# Altium project FPGA_Tester_Board.PrjPcb
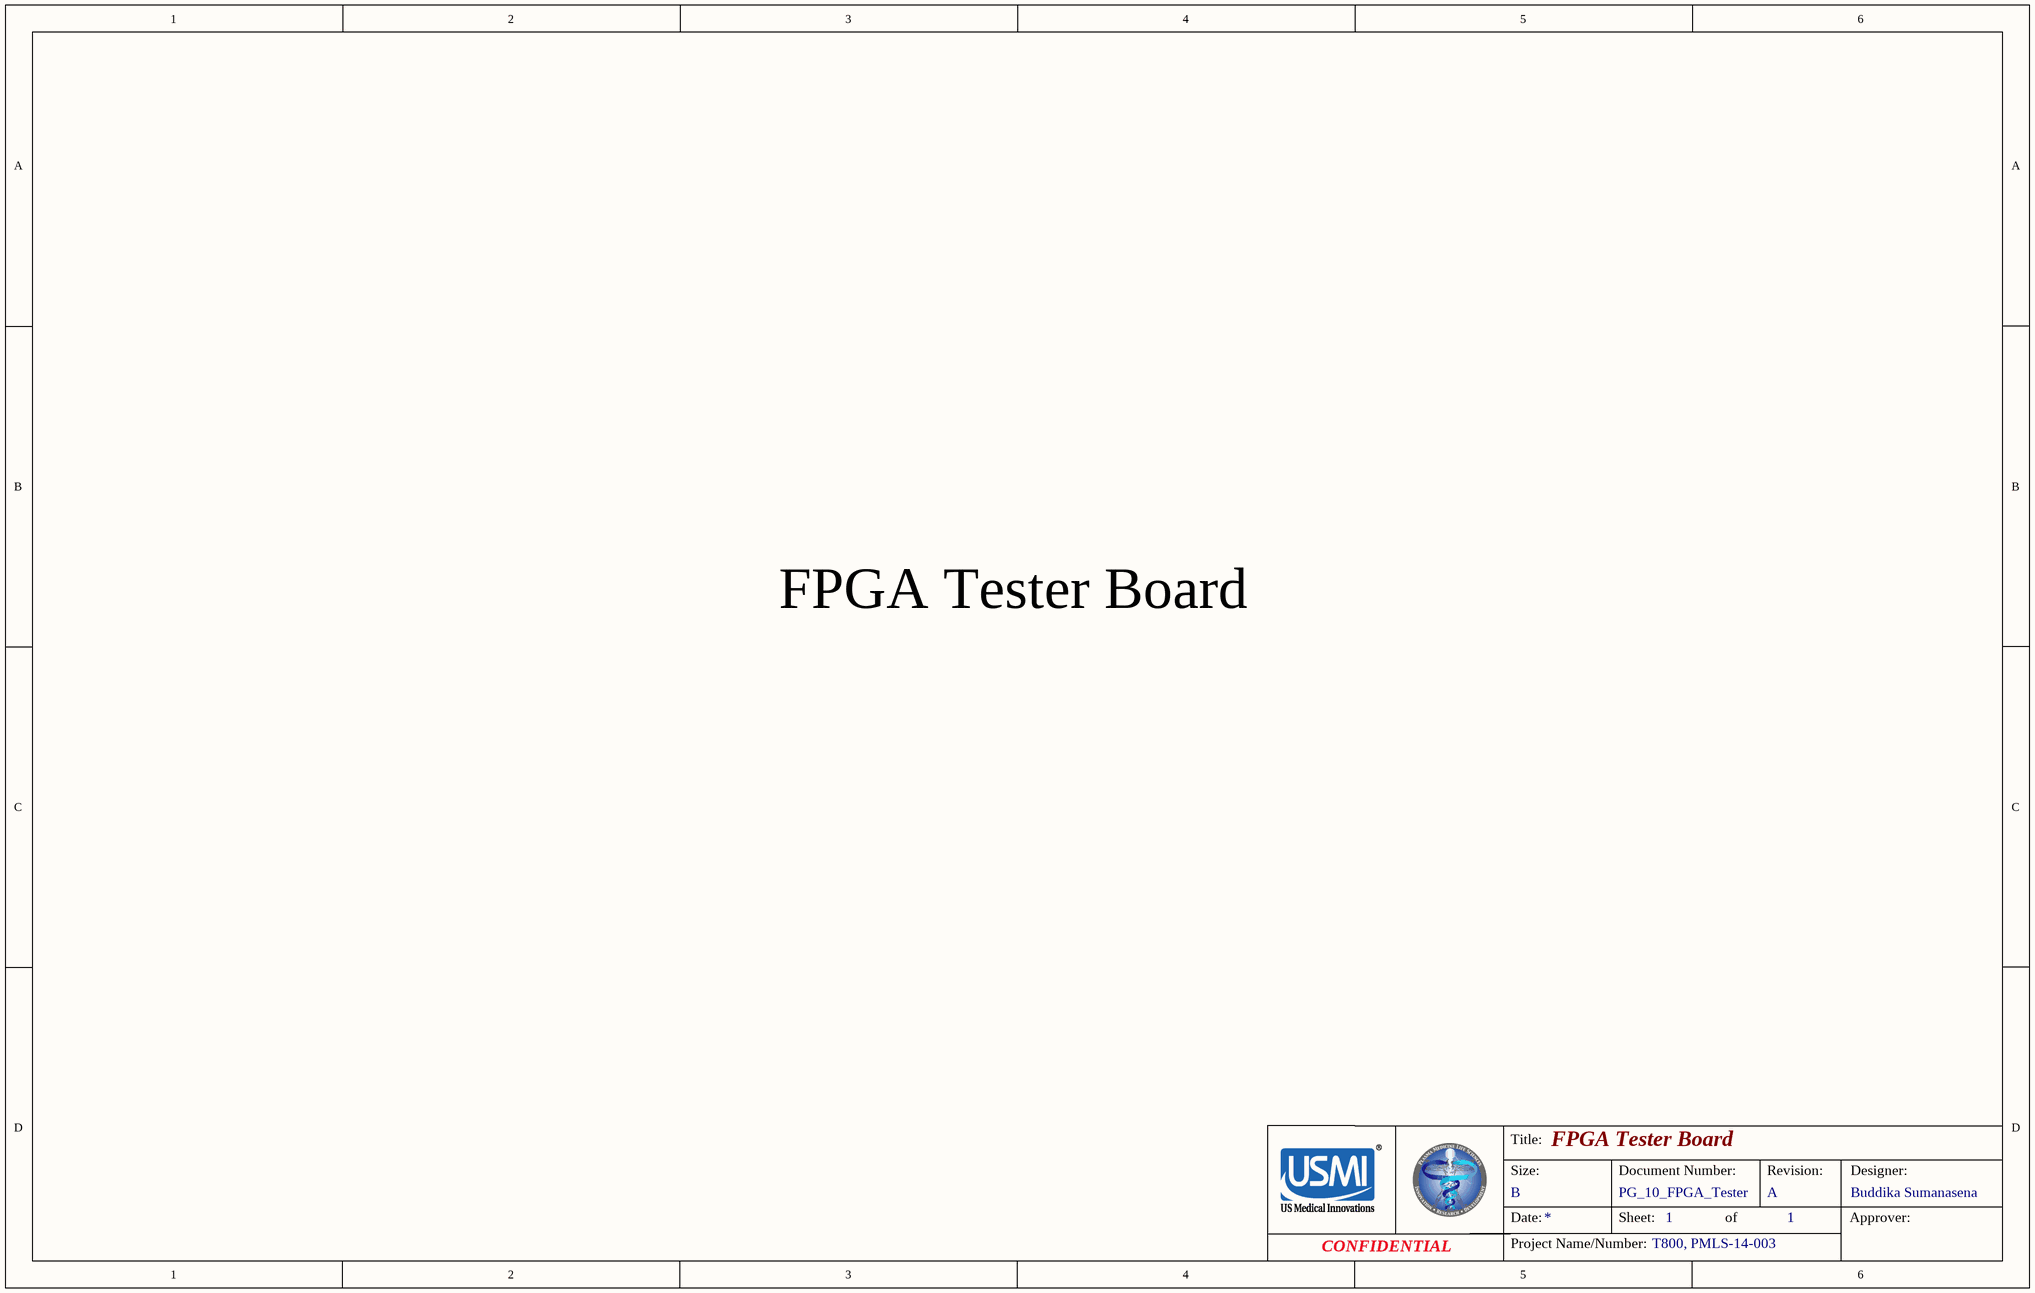
[diagram p0: FPGA_Tester_Board_Cover.SchDoc]
ApprovalDate: 0/31/2019; Author: Buddika Sumanasena; Document_number: PG_10_FPGA_Tester; PCBName: .Pcbdoc; ProjectName/Number: T800, PMLS-14-003; Revision: A; StartDate: 01/31/2019; Title: FPGA Tester Board
5 sheets, 19 parts. Net scope: strictly hierarchical (ports join the sheet entries above them; power ports are local).
Board files: FPGA_Tester_Board.PcbDoc, MainBoard V9.PcbDoc
Sheets:
  FPGA_Tester_Board_Cover.SchDoc
  FPGA_Tester_Board_Signals.SchDoc
    3V3_to_5V_Converter_1 = FPGA_Board_for_Generator__3V3_to_5V_Conv.SchDoc
    Power_Input = Power_Input_Circuit.SchDoc
    MUX_8_TO_1_1 = Multiplexer_8_to_1.SchDoc
    MUX_8_TO_1_2 = Multiplexer_8_to_1.SchDoc

## Sheet FPGA_Tester_Board_Cover.SchDoc: FPGA Tester Board
size B; Author: Buddika Sumanasena; Organization: Altium Limited; Address1: L3, 12a Rodborough Rd; Address2: Frenchs Forest; Address3: NSW; Address4: Australia 2086; Revision: A; SheetNumber: 1; SheetTotal: 1

### Notes on the sheet
- FPGA Tester Board
- Title:
- Size:
- Document Number:
- Revision:
- Designer:
- Date:
- Project Name/Number:
- B
- Sheet:
- of
- Approver:
- CONFIDENTIAL

## Sheet FPGA_Tester_Board_Signals.SchDoc: FPGA Tester Board
size B; Author: Buddika Sumanasena; Organization: Altium Limited; Address1: L3, 12a Rodborough Rd; Address2: Frenchs Forest; Address3: NSW; Address4: Australia 2086; DocumentNumber: 11; Revision: A; SheetNumber: 8; SheetTotal: 21; PageSetup: Record=PageOptions|CenterHorizontal=True|CenterVertical=True|PrintScale=0.72|XCorrection=1.00|YCorrection=1.00|PrintKind=1|BorderSize=5000000|LeftOffset=0|BottomOffset=0|Orientation=2|PaperLength=2794|PaperWidth=2159|Scale=100|PaperSource=7|PrintQuality=600|MediaType=1|DitherType=10|PrintScaleMode=1|PaperKind=Letter|PaperIndex=1
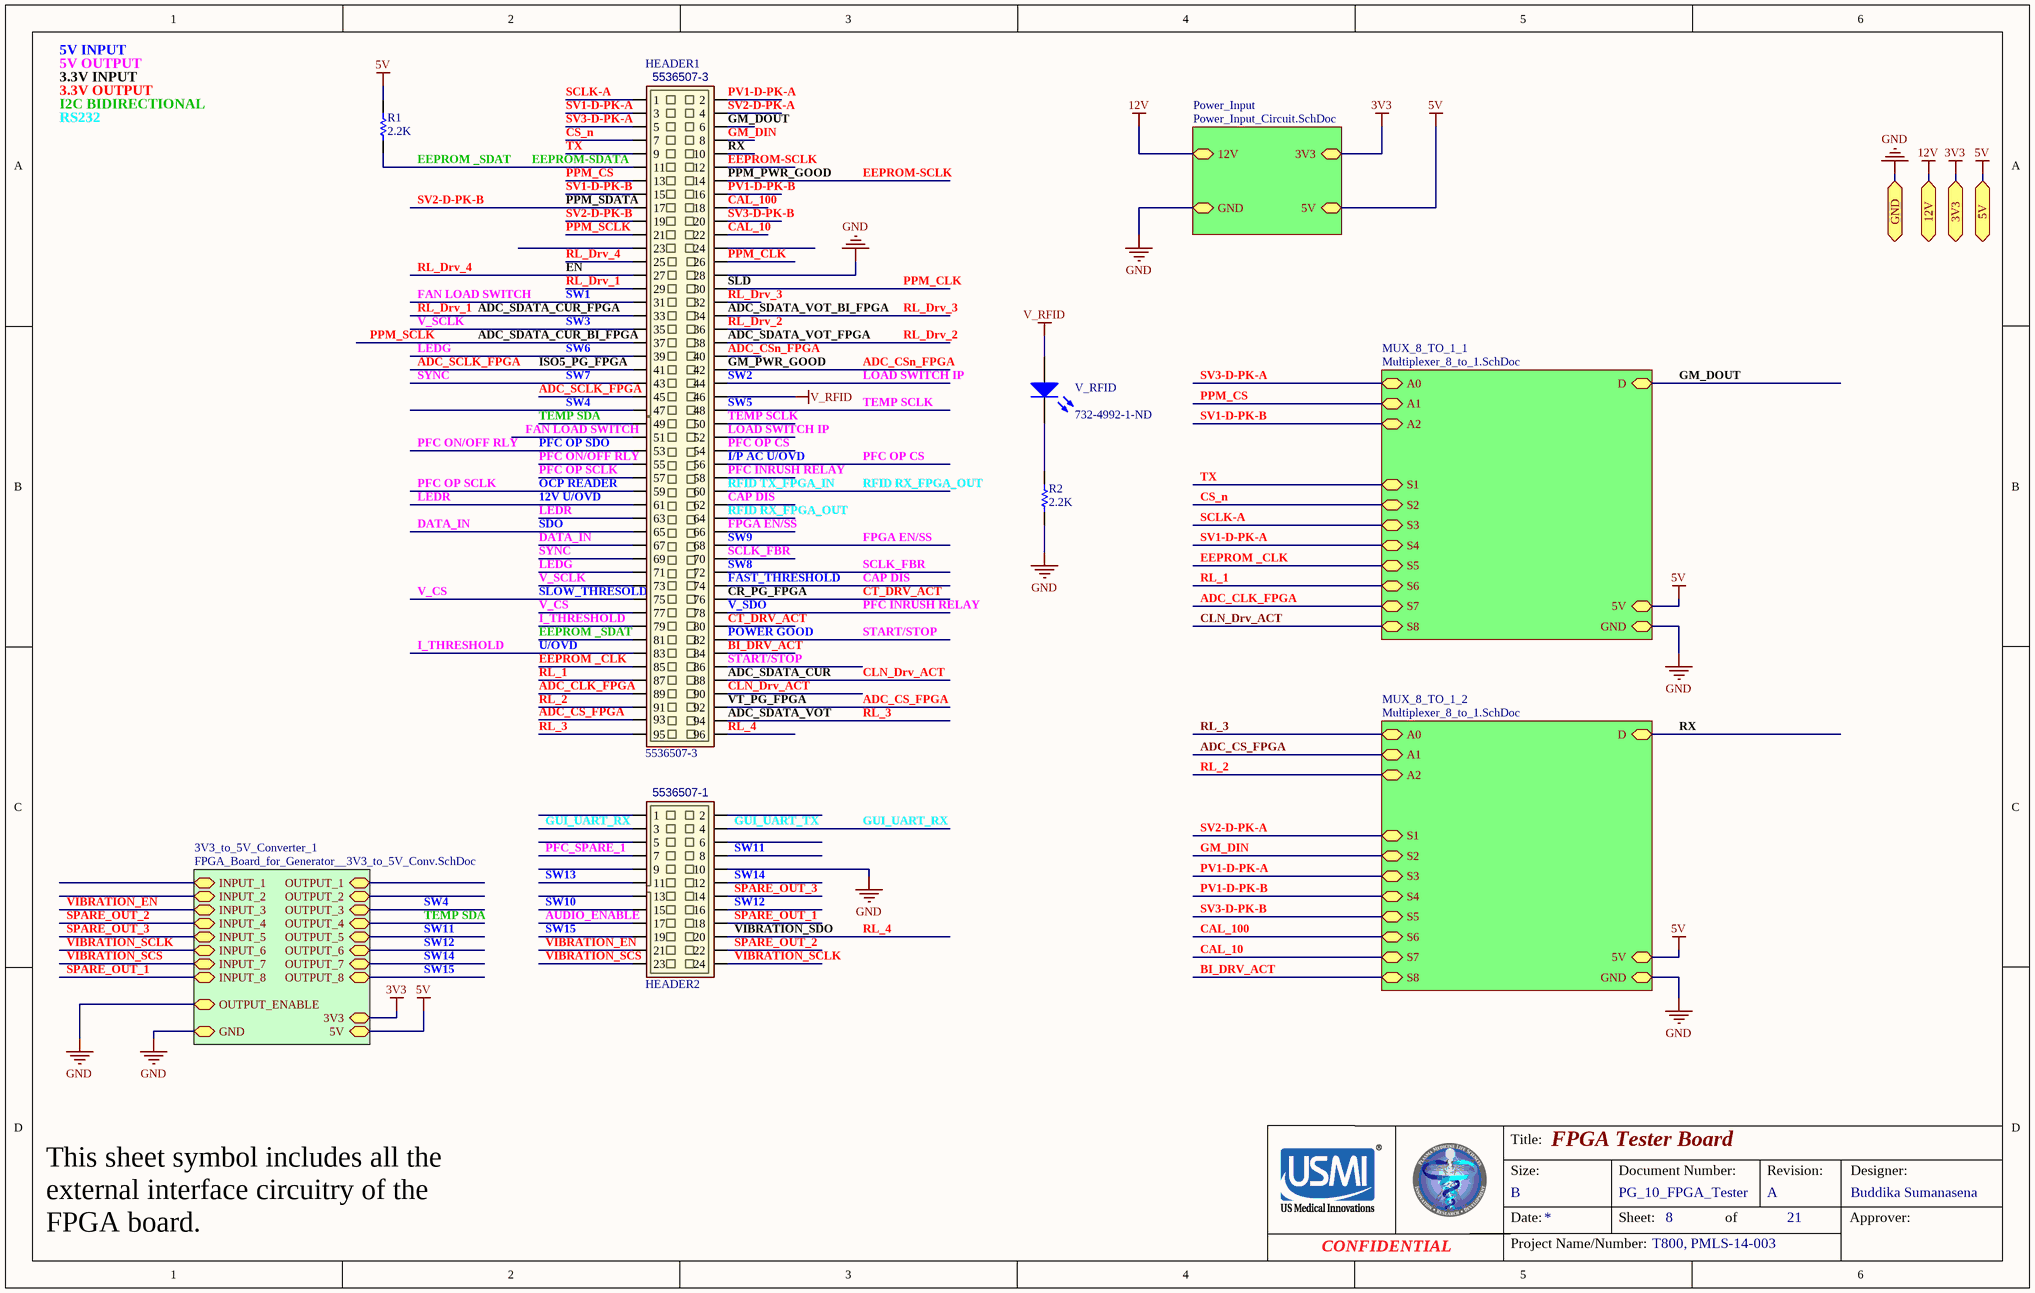
[diagram p1: FPGA_Tester_Board_Signals.SchDoc]

### Parts
HEADER1  5536507-3  [5536501-3]
HEADER2  5536507-1  [5536501-1]  (value not drawn)
R1  2.2K  [0603R]
R2  2.2K  [0603R]
V_RFID  Supplier Part Number 1: 732-4992-1-ND  [1206_A]  (hidden comment: RED)

### Sub-sheets
3V3_to_5V_Converter_1 = FPGA_Board_for_Generator__3V3_to_5V_Conv.SchDoc: INPUT_5, INPUT_7, INPUT_8, INPUT_2, INPUT_6, INPUT_4, INPUT_1, INPUT_3, OUTPUT_5, OUTPUT_4, OUTPUT_6, OUTPUT_1, OUTPUT_2, OUTPUT_3, OUTPUT_7, OUTPUT_8, OUTPUT_ENABLE, GND, 5V, 3V3
MUX_8_TO_1_1 = Multiplexer_8_to_1.SchDoc: A0, S2, S1, A1, S3, S5, GND, A2, S7, S4, S8, D, 5V, S6
MUX_8_TO_1_2 = Multiplexer_8_to_1.SchDoc: D, S2, S6, A0, S3, 5V, S8, S4, S5, S7, A1, A2, S1, GND
Power_Input = Power_Input_Circuit.SchDoc: GND, 3V3, 12V, 5V

### Ports
3V3, 5V, 12V, GND

### Nets
3V3: port 3V3, sheet 3V3_to_5V_Converter_1/3V3, sheet Power_Input/3V3
5V: R1.2 ; port 5V, sheet 3V3_to_5V_Converter_1/5V, sheet Power_Input/5V, sheet MUX_8_TO_1_1/5V, sheet MUX_8_TO_1_2/5V
12V: port 12V, sheet Power_Input/12V
GND: HEADER1.28 HEADER2.10 R2.1 ; port GND, sheet 3V3_to_5V_Converter_1/OUTPUT_ENABLE, sheet 3V3_to_5V_Converter_1/GND, sheet Power_Input/GND, sheet MUX_8_TO_1_1/GND, sheet MUX_8_TO_1_2/GND
V_RFID: HEADER1.46 V_RFID.2(A)
12V U/OVD: HEADER1.61 HEADER1.63  [also labelled LEDR]
ADC_CLK_FPGA: HEADER1.89 ; sheet MUX_8_TO_1_1/S7
ADC_CS_FPGA: HEADER1.92 HEADER1.93 ; sheet MUX_8_TO_1_2/A1  [also labelled VT_PG_FPGA]
ADC_CSn_FPGA: HEADER1.40 HEADER1.42  [also labelled GM_PWR_GOOD]
ADC_SCLK_FPGA: HEADER1.41 HEADER1.45  [also labelled ISO5_PG_FPGA]
ADC_SDATA_CUR: HEADER1.88 HEADER1.90 ; sheet MUX_8_TO_1_1/S8  [also labelled CLN_Drv_ACT]
ADC_SDATA_CUR_BI_FPGA: HEADER1.21 HEADER1.37  [also labelled PPM_SCLK]
ADC_SDATA_CUR_FPGA: HEADER1.29 HEADER1.33  [also labelled RL_Drv_1]
ADC_SDATA_VOT: HEADER1.94 HEADER1.95 ; sheet MUX_8_TO_1_2/A0  [also labelled RL_3]
ADC_SDATA_VOT_BI_FPGA: HEADER1.32 HEADER1.34  [also labelled RL_Drv_3]
ADC_SDATA_VOT_FPGA: HEADER1.36 HEADER1.38  [also labelled RL_Drv_2]
AUDIO_ENABLE: HEADER2.17
BI_DRV_ACT: HEADER1.84 ; sheet MUX_8_TO_1_2/S8
CAL_10: HEADER1.22 ; sheet MUX_8_TO_1_2/S7
CAL_100: HEADER1.18 ; sheet MUX_8_TO_1_2/S6
CAP DIS: HEADER1.62 HEADER1.74  [also labelled FAST_THRESHOLD]
CR_PG_FPGA: HEADER1.76 HEADER1.80  [also labelled CT_DRV_ACT]
CS_n: HEADER1.7 ; sheet MUX_8_TO_1_1/S2
DATA_IN: HEADER1.65 HEADER1.67  [also labelled SDO]
EEPROM _CLK: HEADER1.85 ; sheet MUX_8_TO_1_1/S5
EEPROM _SDAT: HEADER1.11 HEADER1.81 R1.1  [also labelled EEPROM-SDATA]
EEPROM-SCLK: HEADER1.12 HEADER1.14  [also labelled PPM_PWR_GOOD]
EN: HEADER1.25 HEADER1.27  [also labelled RL_Drv_4]
FAN LOAD SWITCH: HEADER1.31 HEADER1.51  [also labelled SW1]
FPGA EN/SS: HEADER1.66 HEADER1.68  [also labelled SW9]
GM_DIN: HEADER1.8 ; sheet MUX_8_TO_1_2/S2
GM_DOUT: HEADER1.6 ; sheet MUX_8_TO_1_1/D
GUI_UART_RX: HEADER2.3 HEADER2.4  [also labelled GUI_UART_TX]
I/P AC U/OVD: HEADER1.54 HEADER1.56  [also labelled PFC OP CS]
I_THRESHOLD: HEADER1.79 HEADER1.83  [also labelled U/OVD]
LEDG: HEADER1.39 HEADER1.71  [also labelled SW6]
LOAD SWITCH IP: HEADER1.44 HEADER1.52  [also labelled SW2]
OCP READER: HEADER1.57 HEADER1.59  [also labelled PFC OP SCLK]
PFC INRUSH RELAY: HEADER1.58 HEADER1.78  [also labelled V_SDO]
PFC ON/OFF RLY: HEADER1.53 HEADER1.55  [also labelled PFC OP SDO]
PFC_SPARE_1: HEADER2.7
POWER GOOD: HEADER1.82 HEADER1.86  [also labelled START/STOP]
PPM_CLK: HEADER1.26 HEADER1.30  [also labelled SLD]
PPM_CS: HEADER1.13 ; sheet MUX_8_TO_1_1/A1
PPM_SDATA: HEADER1.17 HEADER1.19  [also labelled SV2-D-PK-B]
PV1-D-PK-A: HEADER1.2 ; sheet MUX_8_TO_1_2/S3
PV1-D-PK-B: HEADER1.16 ; sheet MUX_8_TO_1_2/S4
RFID RX_FPGA_OUT: HEADER1.60 HEADER1.64  [also labelled RFID TX_FPGA_IN]
RL_1: HEADER1.87 ; sheet MUX_8_TO_1_1/S6
RL_2: HEADER1.91 ; sheet MUX_8_TO_1_2/A2
RL_4: HEADER1.96 HEADER2.20  [also labelled VIBRATION_SDO]
RX: HEADER1.10 ; sheet MUX_8_TO_1_2/D
SCLK-A: HEADER1.1 ; sheet MUX_8_TO_1_1/S3
SCLK_FBR: HEADER1.70 HEADER1.72  [also labelled SW8]
SLOW_THRESOLD: HEADER1.75 HEADER1.77  [also labelled V_CS]
SPARE_OUT_1: HEADER2.18 ; sheet 3V3_to_5V_Converter_1/INPUT_8
SPARE_OUT_2: HEADER2.22 ; sheet 3V3_to_5V_Converter_1/INPUT_4
SPARE_OUT_3: HEADER2.14 ; sheet 3V3_to_5V_Converter_1/INPUT_5
SV1-D-PK-A: HEADER1.3 ; sheet MUX_8_TO_1_1/S4
SV1-D-PK-B: HEADER1.15 ; sheet MUX_8_TO_1_1/A2
SV2-D-PK-A: HEADER1.4 ; sheet MUX_8_TO_1_2/S1
SV3-D-PK-A: HEADER1.5 ; sheet MUX_8_TO_1_1/A0
SV3-D-PK-B: HEADER1.20 ; sheet MUX_8_TO_1_2/S5
SW3: HEADER1.35 HEADER1.73  [also labelled V_SCLK]
SW4: HEADER1.47 ; sheet 3V3_to_5V_Converter_1/OUTPUT_3
SW5: HEADER1.48 HEADER1.50  [also labelled TEMP SCLK]
SW7: HEADER1.43 HEADER1.69  [also labelled SYNC]
SW10: HEADER2.15
SW11: HEADER2.8 ; sheet 3V3_to_5V_Converter_1/OUTPUT_5
SW12: HEADER2.16 ; sheet 3V3_to_5V_Converter_1/OUTPUT_6
SW13: HEADER2.11
SW14: HEADER2.12 ; sheet 3V3_to_5V_Converter_1/OUTPUT_7
SW15: HEADER2.19 ; sheet 3V3_to_5V_Converter_1/OUTPUT_8
TEMP SDA: HEADER1.49 ; sheet 3V3_to_5V_Converter_1/OUTPUT_4
TX: HEADER1.9 ; sheet MUX_8_TO_1_1/S1
VIBRATION_EN: HEADER2.21 ; sheet 3V3_to_5V_Converter_1/INPUT_3
VIBRATION_SCLK: HEADER2.24 ; sheet 3V3_to_5V_Converter_1/INPUT_6
VIBRATION_SCS: HEADER2.23 ; sheet 3V3_to_5V_Converter_1/INPUT_7
NetR2_2: R2.2 V_RFID.1(K)

Not connected (* = marked no-connect by the designer): HEADER1 23 24; HEADER2 1 2 5 6 9 13

### Notes on the sheet
- 5V INPUT
- 5V OUTPUT
- 3.3V INPUT
- 3.3V OUTPUT
- I2C BIDIRECTIONAL
- RS232
- Title:
- Size:
- Document Number:
- Revision:
- Designer:
- This sheet symbol includes all the external interface circuitry of the FPGA board.
- Date:
- Project Name/Number:
- B
- Sheet:
- of
- Approver:
- CONFIDENTIAL

### Library data of the parts
HEADER1 = 5536507-3: TE Z-Pack 5536507-3; Supplier 1: Digi-Key; Supplier 2: Mouser; Supplier Part Number 2: 571-5536507-3; Supplier Part Number 1: A31557-ND
HEADER2 = 5536507-1: TE Z-Pack 5536507-1; Supplier 1: Digi-Key; Supplier 2: Mouser; Supplier Part Number 1: A31555-ND; Supplier Part Number 2: 571-5536507-1
R1 R2 = Res1: Resistor; Published: 8-Jun-2000; LatestRevisionDate: 17-Jul-2002; LatestRevisionNote: Re-released for DXP Platform.; PackageReference: AXIAL-0.3; Publisher: Altium Limited; PackageDescription: Axial Device, Thru-Hole; 2 Leads; 0.3 in Pin Spacing; Value: 2.2K; Supplier 1: Digi-Key; Supplier Part Number 1: 311-2.20KHRCT-ND
V_RFID = CMP-1426-00017-1: SMD mono-color Chip LED, WL-SMCW, Super Red; Manufacturer: Wuerth Elektronik; PartNumber: 150120SS75000; ComponentLink1URL: http://www.we-online.com; PackageReference: 1206_A; ComponentLink2Description: Datasheet; ComponentLink1Description: Manufacturer URL; ComponentLink2URL: http://katalog.we-online.com/led/datasheet/150120SS75000.pdf; Color: Super Red; Supplier 1: Digi-Key

## Sheet FPGA_Board_for_Generator__3V3_to_5V_Conv.SchDoc: FPGA Tester Board
size B; Author: Buddika Sumanasena; Organization: Altium Limited; Address1: L3, 12a Rodborough Rd; Address2: Frenchs Forest; Address3: NSW; Address4: Australia 2086; DocumentNumber: 4; Revision: A; SheetNumber: 3; SheetTotal: 21
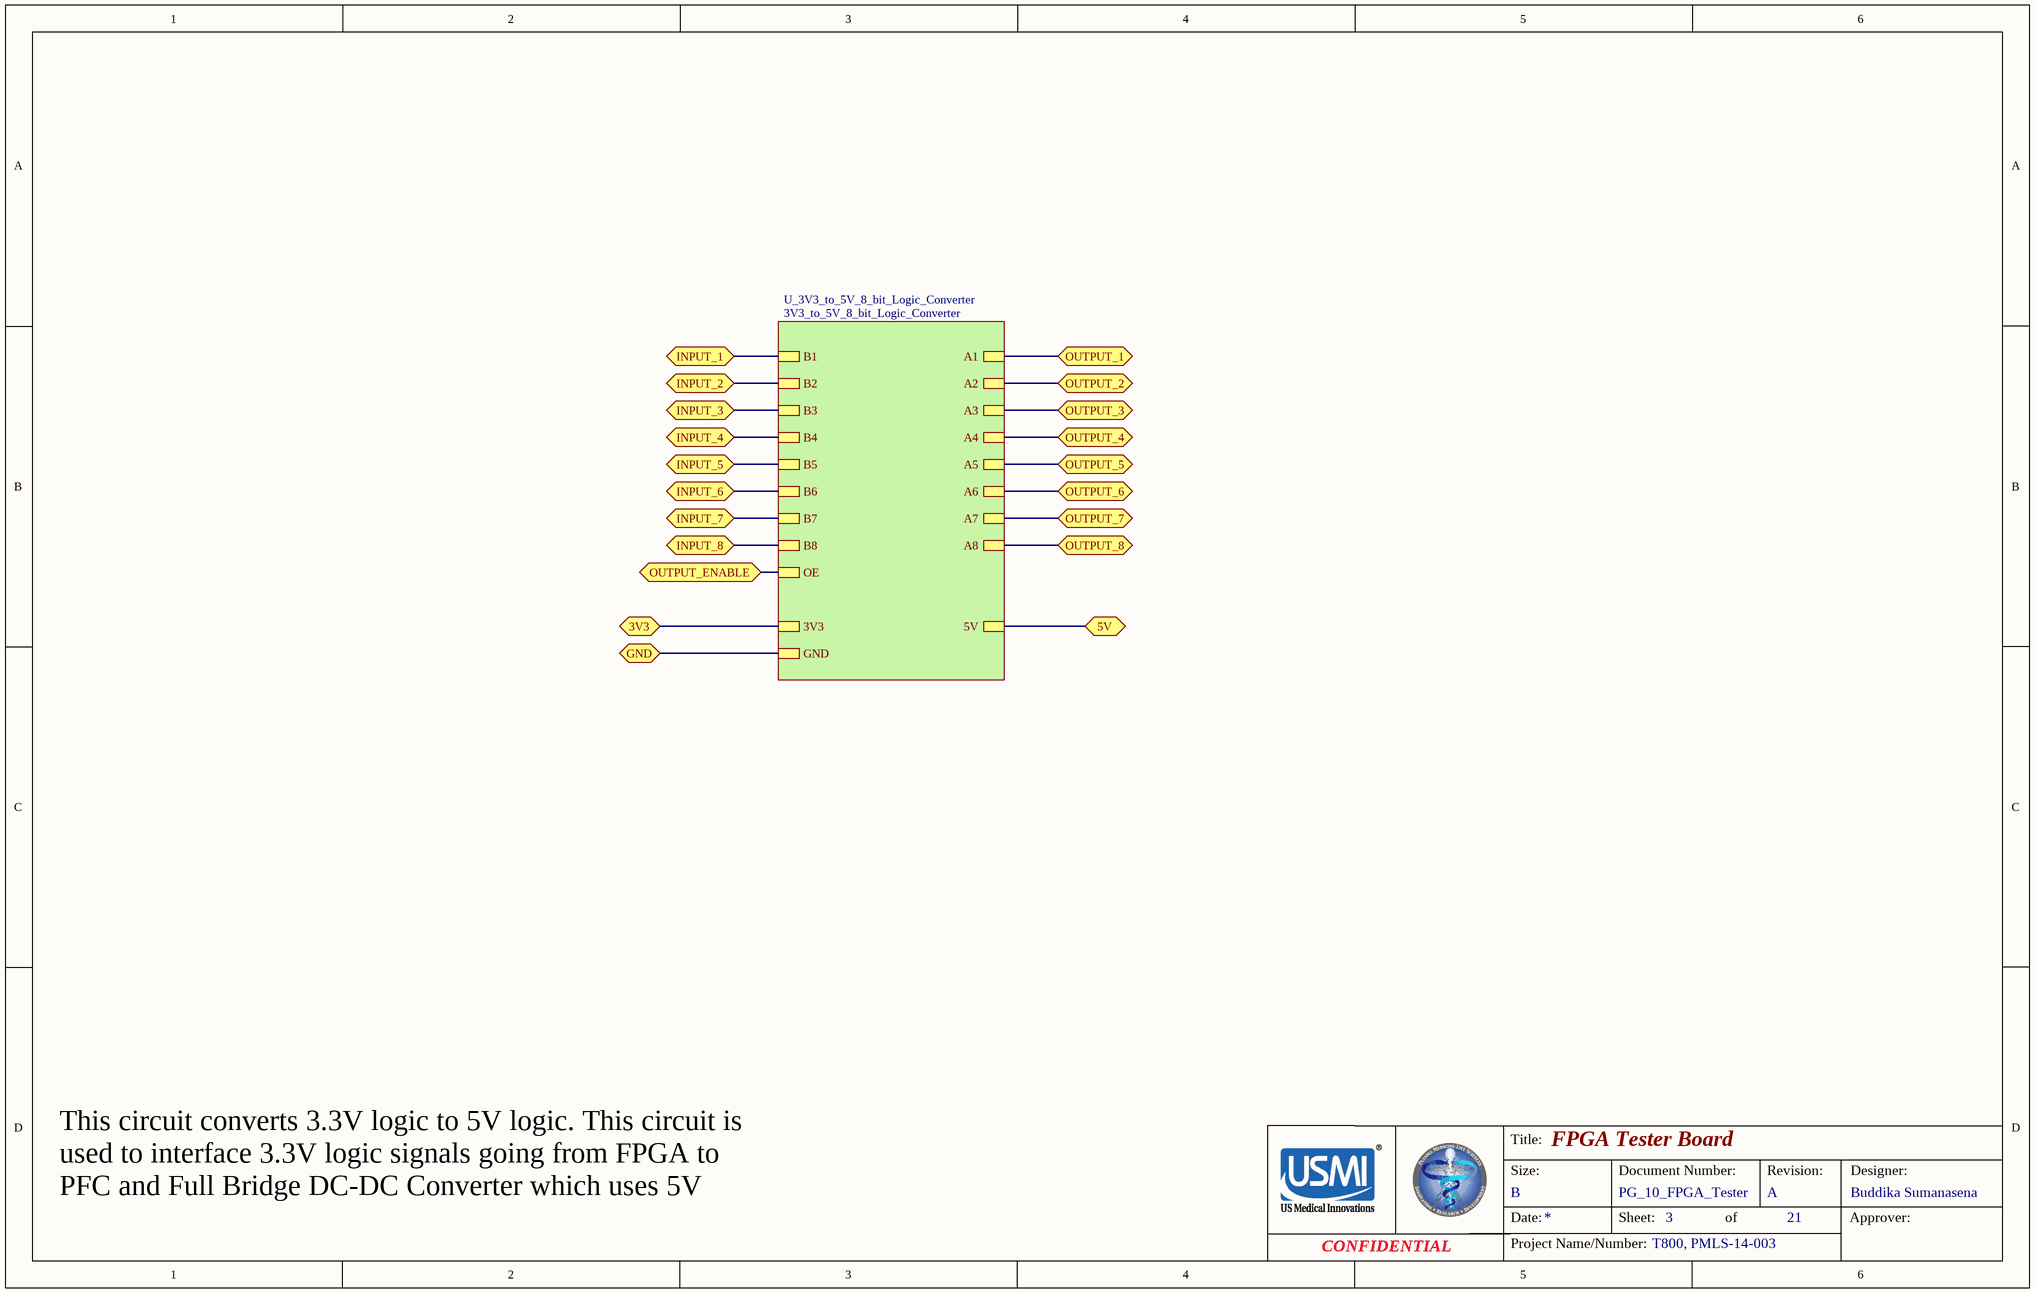
[diagram p2: FPGA_Board_for_Generator__3V3_to_5V_Conv.SchDoc]

### Sub-sheets
U_3V3_to_5V_8_bit_Logic_Converter = 3V3_to_5V_8_bit_Logic_Converter (file not in this document): A1, A2, A3, A4, A5, A6, A7, A8, B1, B2, B3, B4, B5, B6, B7, B8, OE, 5V, 3V3, GND

### Ports
3V3, 5V, GND, INPUT_1, INPUT_2, INPUT_3, INPUT_4, INPUT_5, INPUT_6, INPUT_7, INPUT_8, OUTPUT_1, OUTPUT_2, OUTPUT_3, OUTPUT_4, OUTPUT_5, OUTPUT_6, OUTPUT_7, OUTPUT_8, OUTPUT_ENABLE

### Nets
3V3: port 3V3, sheet U_3V3_to_5V_8_bit_Logic_Converter/3V3
5V: port 5V, sheet U_3V3_to_5V_8_bit_Logic_Converter/5V
GND: port OUTPUT_ENABLE, port GND, sheet U_3V3_to_5V_8_bit_Logic_Converter/OE, sheet U_3V3_to_5V_8_bit_Logic_Converter/GND
SPARE_OUT_1: port INPUT_8, sheet U_3V3_to_5V_8_bit_Logic_Converter/B8
SPARE_OUT_2: port INPUT_4, sheet U_3V3_to_5V_8_bit_Logic_Converter/B4
SPARE_OUT_3: port INPUT_5, sheet U_3V3_to_5V_8_bit_Logic_Converter/B5
SW4: port OUTPUT_3, sheet U_3V3_to_5V_8_bit_Logic_Converter/A3
SW11: port OUTPUT_5, sheet U_3V3_to_5V_8_bit_Logic_Converter/A5
SW12: port OUTPUT_6, sheet U_3V3_to_5V_8_bit_Logic_Converter/A6
SW14: port OUTPUT_7, sheet U_3V3_to_5V_8_bit_Logic_Converter/A7
SW15: port OUTPUT_8, sheet U_3V3_to_5V_8_bit_Logic_Converter/A8
TEMP SDA: port OUTPUT_4, sheet U_3V3_to_5V_8_bit_Logic_Converter/A4
VIBRATION_EN: port INPUT_3, sheet U_3V3_to_5V_8_bit_Logic_Converter/B3
VIBRATION_SCLK: port INPUT_6, sheet U_3V3_to_5V_8_bit_Logic_Converter/B6
VIBRATION_SCS: port INPUT_7, sheet U_3V3_to_5V_8_bit_Logic_Converter/B7
(unnamed): port INPUT_2, sheet U_3V3_to_5V_8_bit_Logic_Converter/B2
(unnamed): port INPUT_1, sheet U_3V3_to_5V_8_bit_Logic_Converter/B1
(unnamed): port OUTPUT_1, sheet U_3V3_to_5V_8_bit_Logic_Converter/A1
(unnamed): port OUTPUT_2, sheet U_3V3_to_5V_8_bit_Logic_Converter/A2

### Notes on the sheet
- Title:
- Size:
- Document Number:
- Revision:
- Designer:
- This circuit converts 3.3V logic to 5V logic. This circuit is used to interface 3.3V logic signals going from FPGA to PFC and Full Bridge DC-DC Converter which uses 5V logic.
- Date:
- Project Name/Number:
- B
- Sheet:
- of
- Approver:
- CONFIDENTIAL

## Sheet Power_Input_Circuit.SchDoc: FPGA Tester Board
size B; Author: Buddika Sumanasena; Organization: Altium Limited; Address1: L3, 12a Rodborough Rd; Address2: Frenchs Forest; Address3: NSW; Address4: Australia 2086; DocumentNumber: 20; Revision: A; SheetNumber: 17; SheetTotal: 21
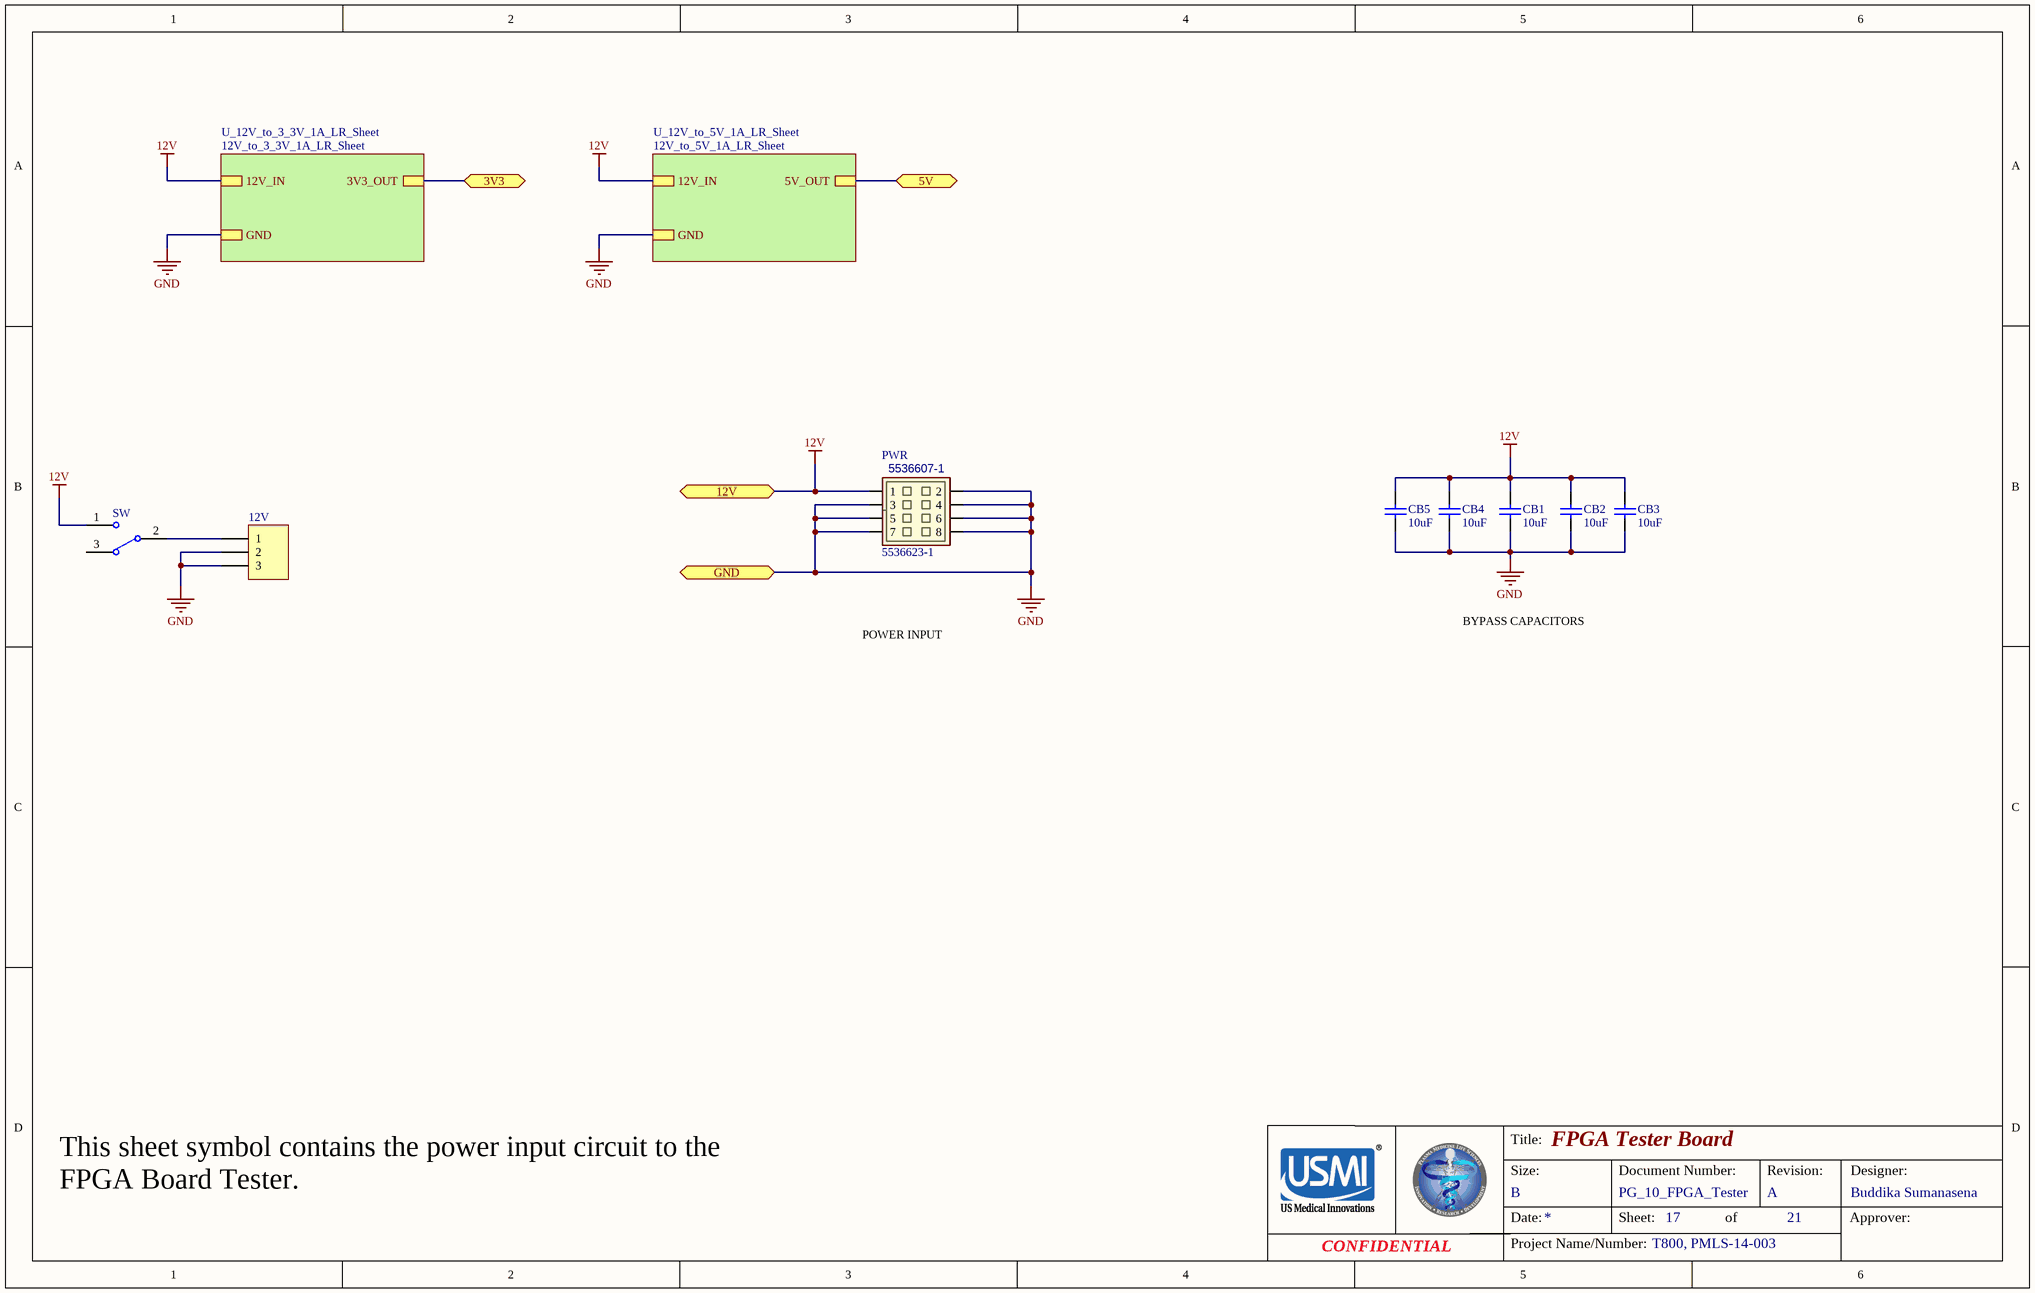
[diagram p3: Power_Input_Circuit.SchDoc]

### Parts
12V  Header 3  [HDR1X3_12V]  (value not drawn)
CB1  10uF  [1206c]
CB2  10uF  [1206c]
CB3  10uF  [1206c]
CB4  10uF  [1206c]
CB5  10uF  [1206c]
PWR  5536623-1  [5536623-1]
SW  SW  [CS12ANW03]  (value not drawn)

### Sub-sheets
U_12V_to_3_3V_1A_LR_Sheet = 12V_to_3_3V_1A_LR_Sheet (file not in this document): GND, 12V_IN, 3V3_OUT
U_12V_to_5V_1A_LR_Sheet = 12V_to_5V_1A_LR_Sheet (file not in this document): GND, 12V_IN, 5V_OUT

### Ports
3V3, 5V, 12V, GND

### Nets
3V3: port 3V3, sheet U_12V_to_3_3V_1A_LR_Sheet/3V3_OUT
5V: port 5V, sheet U_12V_to_5V_1A_LR_Sheet/5V_OUT
12V: CB1.2 CB2.2 CB3.2 CB4.2 CB5.2 PWR.1 SW.1 ; port 12V, sheet U_12V_to_3_3V_1A_LR_Sheet/12V_IN, sheet U_12V_to_5V_1A_LR_Sheet/12V_IN
GND: 12V.2 12V.3 CB1.1 CB2.1 CB3.1 CB4.1 CB5.1 PWR.2 PWR.3 PWR.4 PWR.5 PWR.6 PWR.7 PWR.8 ; port GND, sheet U_12V_to_3_3V_1A_LR_Sheet/GND, sheet U_12V_to_5V_1A_LR_Sheet/GND
Net12V_1: 12V.1 SW.2

Not connected (* = marked no-connect by the designer): SW 3

### Notes on the sheet
- BYPASS CAPACITORS
- POWER INPUT
- Title:
- Size:
- Document Number:
- Revision:
- Designer:
- This sheet symbol contains the power input circuit to the FPGA Board Tester.
- Date:
- Project Name/Number:
- B
- Sheet:
- of
- Approver:
- CONFIDENTIAL

### Library data of the parts
12V = Header 3: Header, 3-Pin; LatestRevisionDate: 17-Jul-2002; LatestRevisionNote: Re-released for DXP Platform.; Publisher: Altium Limited; Supplier 1: Digi-Key; Supplier Part Number 2: WM8214-ND; Supplier 2: Digi-Key; Supplier Part Number 1: A32564-ND
CB1-CB5 = Cap: Capacitor; Published: 8-Jun-2000; LatestRevisionDate: 17-Jul-2002; LatestRevisionNote: Re-released for DXP Platform.; PackageReference: RAD-0.3; Publisher: Altium Limited; PackageDescription: Radial Cap, Thru-Hole; 2 Leads; 0.3 in Pin Spacing; Value: 10uF; Supplier 1: Digi-Key; Supplier Part Number 1: 1276-2876-1-ND
PWR = 5536607-1: TE Z-Pack 5536607-1; Supplier 2: Mouser; Supplier 1: Digi-Key; Supplier Part Number 2: 571-5536607-1; Supplier Part Number 1: 5536623-1-ND
SW = SW-SPDT: SPDT Subminiature Toggle Switch, Right Angle Mounting, Vertical Actuation; Published: 24-Mar-1999; LatestRevisionDate: 17-Dec-2003; LatestRevisionNote: Schematic revised, PCB Footprint replaced.; DatasheetVersion: 05-Dec-2000; PackageReference: TL36WW15050; Publisher: Altium Limited; PackageDescription: Switch; 4 Leads; ComponentLink1Description: Manufacturer Link; ComponentLink1URL: http://www.apem.com; Supplier 1: Digi-Key; Supplier 2: Digi-Key; Supplier Part Number 2: 679-1882-ND; Supplier Part Number 1: 360-2131-ND

## Sheet Multiplexer_8_to_1.SchDoc: FPGA Tester Board
size B; Author: Buddika Sumanasena; Organization: Altium Limited; Address1: L3, 12a Rodborough Rd; Address2: Frenchs Forest; Address3: NSW; Address4: Australia 2086; Revision: A; SheetNumber: 1; SheetTotal: 1
Used 2 times, as channels MUX_8_TO_1_1, MUX_8_TO_1_2. Parts and nets are listed once, with the designators drawn on the sheet.
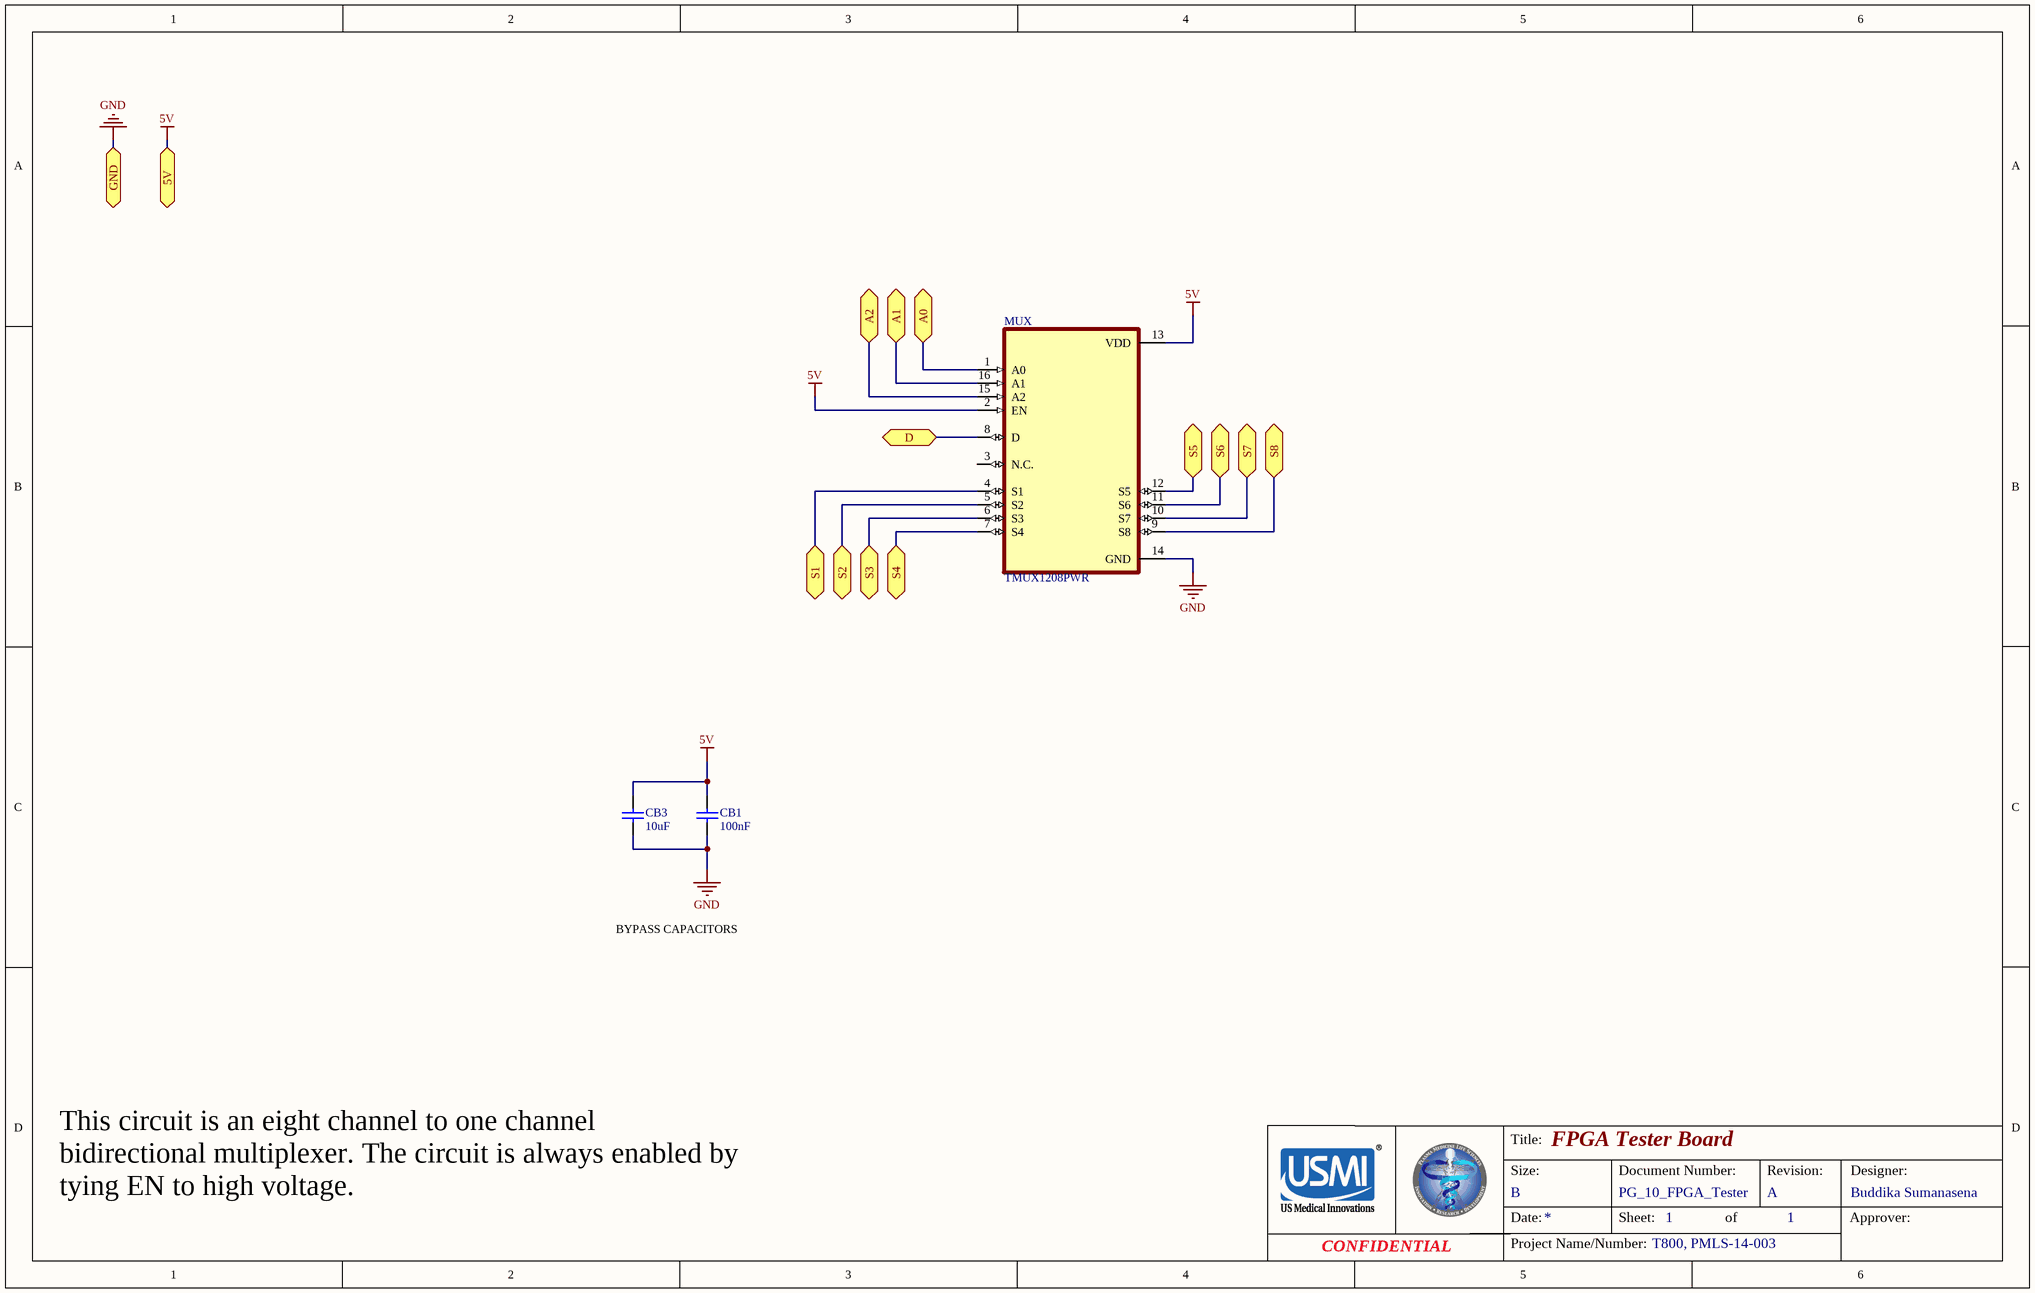
[diagram p4: Multiplexer_8_to_1.SchDoc]

### Parts
CB1  100nF  [0805c]
CB3  10uF  [1206c]
MUX  TMUX1208PWR  [SOP65P640X120-16N]

### Ports
5V, A0, A1, A2, D, GND, S1, S2, S3, S4, S5, S6, S7, S8

### Nets
5V: CB1.2 CB3.2 MUX.2(EN) MUX.13(VDD) ; port 5V
GND: CB1.1 CB3.1 MUX.14(GND) ; port GND
A0: MUX.1(A0) ; port A0
A1: MUX.16(A1) ; port A1
A2: MUX.15(A2) ; port A2
D: MUX.8(D) ; port D
S1: MUX.4(S1) ; port S1
S2: MUX.5(S2) ; port S2
S3: MUX.6(S3) ; port S3
S4: MUX.7(S4) ; port S4
S5: MUX.12(S5) ; port S5
S6: MUX.11(S6) ; port S6
S7: MUX.10(S7) ; port S7
S8: MUX.9(S8) ; port S8

Not connected (* = marked no-connect by the designer): MUX 3(N.C.)

### Channels
MUX_8_TO_1_1: designators CB1=CB14 CB3=CB13 MUX=MUX1; ports 5V=5V A0=SV3-D-PK-A A1=PPM_CS A2=SV1-D-PK-B D=GM_DOUT GND=GND S1=TX S2=CS_n S3=SCLK-A S4=SV1-D-PK-A S5=EEPROM _CLK S6=RL_1 S7=ADC_CLK_FPGA S8=ADC_SDATA_CUR
MUX_8_TO_1_2: designators CB1=CB16 CB3=CB15 MUX=MUX2; ports 5V=5V A0=ADC_SDATA_VOT A1=ADC_CS_FPGA A2=RL_2 D=RX GND=GND S1=SV2-D-PK-A S2=GM_DIN S3=PV1-D-PK-A S4=PV1-D-PK-B S5=SV3-D-PK-B S6=CAL_100 S7=CAL_10 S8=BI_DRV_ACT

### Notes on the sheet
- BYPASS CAPACITORS
- Title:
- Size:
- Document Number:
- Revision:
- Designer:
- This circuit is an eight channel to one channel bidirectional multiplexer. The circuit is always enabled by tying EN to high voltage.
- Date:
- Project Name/Number:
- B
- Sheet:
- of
- Approver:
- CONFIDENTIAL

### Library data of the parts
CB1 CB3 = Cap: Capacitor; Published: 8-Jun-2000; LatestRevisionDate: 17-Jul-2002; LatestRevisionNote: Re-released for DXP Platform.; PackageReference: RAD-0.3; Publisher: Altium Limited; PackageDescription: Radial Cap, Thru-Hole; 2 Leads; 0.3 in Pin Spacing; Supplier 1: Digi-Key
  CB1: Value: 100nF; Supplier Part Number 1: 490-8049-6-ND
  CB3: Value: 10uF; Supplier Part Number 1: 1276-2876-1-ND
MUX = TMUX1208PWR: 5-V, 8:1, 1-channel general-purpose analog multiplexer with 1.8-V input logic 16-TSSOP -40 to 125; MF: Texas Instruments; Mouser-Purchase-URL: https://snapeda.com/shop?store=Mouser&id=3223186; DigiKey-Purchase-URL: https://snapeda.com/shop?store=DigiKey&id=3223186; SnapEDA_Link: https://www.snapeda.com/parts/TMUX1208PWR/Texas%20Instruments/view-part/3223186/?ref=snap; MP: TMUX1208PWR; Texas_Instruments-Purchase-URL: https://snapeda.com/shop?store=Texas+Instruments&id=3223186; Availability: Warning; Price: None; Value: *; Package: TSSOP-16 Texas Instruments; Check_prices: https://www.snapeda.com/parts/TMUX1208PWR/Texas%20Instruments/view-part/3223186/?ref=eda; Supplier Part Number 1: 296-51847-1-ND; Supplier 1: Digikey

## Nets that join several sheets
5V: FPGA_Tester_Board_Signals (R1.2), MUX_8_TO_1_1 (CB13.2 CB14.2 MUX1.2 MUX1.13), MUX_8_TO_1_2 (CB15.2 CB16.2 MUX2.2 MUX2.13)
GND: FPGA_Tester_Board_Signals (HEADER1.28 HEADER2.10 R2.1), Power_Input_Circuit (14 pins), MUX_8_TO_1_1 (CB13.1 CB14.1 MUX1.14), MUX_8_TO_1_2 (CB15.1 CB16.1 MUX2.14)
ADC_CLK_FPGA: FPGA_Tester_Board_Signals (HEADER1.89), MUX_8_TO_1_1 (MUX1.10)
ADC_CS_FPGA: FPGA_Tester_Board_Signals (HEADER1.92 HEADER1.93), MUX_8_TO_1_2 (MUX2.16)
ADC_SDATA_CUR: FPGA_Tester_Board_Signals (HEADER1.88 HEADER1.90), MUX_8_TO_1_1 (MUX1.9)
ADC_SDATA_VOT: FPGA_Tester_Board_Signals (HEADER1.94 HEADER1.95), MUX_8_TO_1_2 (MUX2.1)
BI_DRV_ACT: FPGA_Tester_Board_Signals (HEADER1.84), MUX_8_TO_1_2 (MUX2.9)
CAL_10: FPGA_Tester_Board_Signals (HEADER1.22), MUX_8_TO_1_2 (MUX2.10)
CAL_100: FPGA_Tester_Board_Signals (HEADER1.18), MUX_8_TO_1_2 (MUX2.11)
CS_n: FPGA_Tester_Board_Signals (HEADER1.7), MUX_8_TO_1_1 (MUX1.5)
EEPROM _CLK: FPGA_Tester_Board_Signals (HEADER1.85), MUX_8_TO_1_1 (MUX1.12)
GM_DIN: FPGA_Tester_Board_Signals (HEADER1.8), MUX_8_TO_1_2 (MUX2.5)
GM_DOUT: FPGA_Tester_Board_Signals (HEADER1.6), MUX_8_TO_1_1 (MUX1.8)
PPM_CS: FPGA_Tester_Board_Signals (HEADER1.13), MUX_8_TO_1_1 (MUX1.16)
PV1-D-PK-A: FPGA_Tester_Board_Signals (HEADER1.2), MUX_8_TO_1_2 (MUX2.6)
PV1-D-PK-B: FPGA_Tester_Board_Signals (HEADER1.16), MUX_8_TO_1_2 (MUX2.7)
RL_1: FPGA_Tester_Board_Signals (HEADER1.87), MUX_8_TO_1_1 (MUX1.11)
RL_2: FPGA_Tester_Board_Signals (HEADER1.91), MUX_8_TO_1_2 (MUX2.15)
RX: FPGA_Tester_Board_Signals (HEADER1.10), MUX_8_TO_1_2 (MUX2.8)
SCLK-A: FPGA_Tester_Board_Signals (HEADER1.1), MUX_8_TO_1_1 (MUX1.6)
SV1-D-PK-A: FPGA_Tester_Board_Signals (HEADER1.3), MUX_8_TO_1_1 (MUX1.7)
SV1-D-PK-B: FPGA_Tester_Board_Signals (HEADER1.15), MUX_8_TO_1_1 (MUX1.15)
SV2-D-PK-A: FPGA_Tester_Board_Signals (HEADER1.4), MUX_8_TO_1_2 (MUX2.4)
SV3-D-PK-A: FPGA_Tester_Board_Signals (HEADER1.5), MUX_8_TO_1_1 (MUX1.1)
SV3-D-PK-B: FPGA_Tester_Board_Signals (HEADER1.20), MUX_8_TO_1_2 (MUX2.12)
TX: FPGA_Tester_Board_Signals (HEADER1.9), MUX_8_TO_1_1 (MUX1.4)